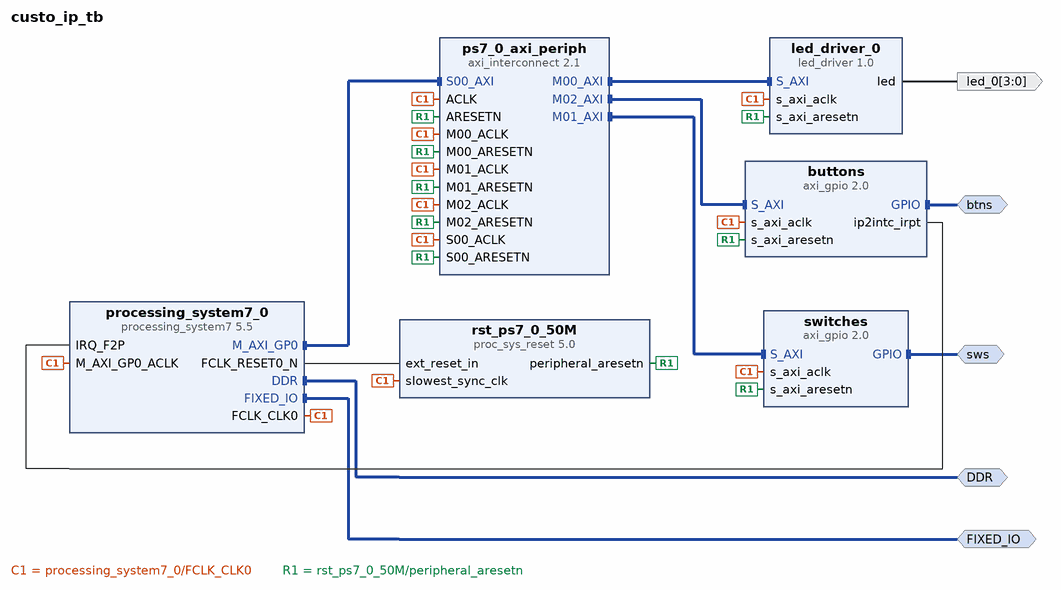
[diagram p0: block diagram of the top level]
# Vivado block design custo_ip_tb, xc7z010clg400-1, Vivado 2018.3
create_bd_design custo_ip_tb

create_bd_intf_port -mode Master -vlnv xilinx.com:interface:ddrx_rtl:1.0 DDR
create_bd_intf_port -mode Master -vlnv xilinx.com:display_processing_system7:fixedio_rtl:1.0 FIXED_IO
create_bd_intf_port -mode Master -vlnv xilinx.com:interface:gpio_rtl:1.0 sws
create_bd_intf_port -mode Master -vlnv xilinx.com:interface:gpio_rtl:1.0 btns
create_bd_port -dir O -from 3 -to 0 led_0

create_bd_cell -type ip -vlnv xilinx.com:user:led_driver:1.0 led_driver_0
create_bd_cell -type ip -vlnv xilinx.com:ip:processing_system7:5.5 processing_system7_0
set_property -dict [list \
  CONFIG.PCW_APU_PERIPHERAL_FREQMHZ 667 \
  CONFIG.PCW_ENET0_ENET0_IO {MIO 16 .. 27} \
  CONFIG.PCW_ENET0_GRP_MDIO_ENABLE 1 \
  CONFIG.PCW_ENET0_GRP_MDIO_IO {MIO 52 .. 53} \
  CONFIG.PCW_ENET0_PERIPHERAL_ENABLE 1 \
  CONFIG.PCW_ENET0_RESET_ENABLE 0 \
  CONFIG.PCW_ENET_RESET_ENABLE 1 \
  CONFIG.PCW_ENET_RESET_SELECT {Share reset pin} \
  CONFIG.PCW_GPIO_MIO_GPIO_ENABLE 1 \
  CONFIG.PCW_GPIO_MIO_GPIO_IO MIO \
  CONFIG.PCW_I2C_RESET_ENABLE 1 \
  CONFIG.PCW_IRQ_F2P_INTR 1 \
  CONFIG.PCW_PRESET_BANK1_VOLTAGE {LVCMOS 1.8V} \
  CONFIG.PCW_QSPI_GRP_FBCLK_ENABLE 1 \
  CONFIG.PCW_QSPI_GRP_FBCLK_IO {MIO 8} \
  CONFIG.PCW_QSPI_GRP_SINGLE_SS_ENABLE 1 \
  CONFIG.PCW_QSPI_GRP_SINGLE_SS_IO {MIO 1 .. 6} \
  CONFIG.PCW_QSPI_PERIPHERAL_ENABLE 1 \
  CONFIG.PCW_QSPI_QSPI_IO {MIO 1 .. 6} \
  CONFIG.PCW_SD0_GRP_CD_ENABLE 1 \
  CONFIG.PCW_SD0_GRP_CD_IO {MIO 47} \
  CONFIG.PCW_SD0_GRP_WP_ENABLE 0 \
  CONFIG.PCW_SD0_PERIPHERAL_ENABLE 1 \
  CONFIG.PCW_SD0_SD0_IO {MIO 40 .. 45} \
  CONFIG.PCW_SDIO_PERIPHERAL_FREQMHZ 50 \
  CONFIG.PCW_SINGLE_QSPI_DATA_MODE x4 \
  CONFIG.PCW_UART1_PERIPHERAL_ENABLE 1 \
  CONFIG.PCW_UART1_UART1_IO {MIO 48 .. 49} \
  CONFIG.PCW_UART_PERIPHERAL_FREQMHZ 100 \
  CONFIG.PCW_UIPARAM_DDR_FREQ_MHZ 533.333333 \
  CONFIG.PCW_UIPARAM_DDR_MEMORY_TYPE {DDR 3 (Low Voltage)} \
  CONFIG.PCW_UIPARAM_DDR_PARTNO {MT41K256M16 RE-125} \
  CONFIG.PCW_USB0_PERIPHERAL_ENABLE 1 \
  CONFIG.PCW_USB0_RESET_ENABLE 1 \
  CONFIG.PCW_USB0_RESET_IO {MIO 46} \
  CONFIG.PCW_USB0_USB0_IO {MIO 28 .. 39} \
  CONFIG.PCW_USB_RESET_ENABLE 1 \
  CONFIG.PCW_USB_RESET_SELECT {Share reset pin} \
  CONFIG.PCW_USE_FABRIC_INTERRUPT 1 \
] [get_bd_cells processing_system7_0]
# 296 more settings of processing_system7_0 are not shown: defaults, MIO pin electricals, DDR timing, and values the tool derives
create_bd_cell -type ip -vlnv xilinx.com:ip:axi_interconnect:2.1 ps7_0_axi_periph
set_property -dict {CONFIG.NUM_MI 3} [get_bd_cells ps7_0_axi_periph]
create_bd_cell -type ip -vlnv xilinx.com:ip:proc_sys_reset:5.0 rst_ps7_0_50M
create_bd_cell -type ip -vlnv xilinx.com:ip:axi_gpio:2.0 switches
set_property -dict {CONFIG.GPIO_BOARD_INTERFACE sws_4bits} [get_bd_cells switches]
create_bd_cell -type ip -vlnv xilinx.com:ip:axi_gpio:2.0 buttons
set_property -dict {CONFIG.C_INTERRUPT_PRESENT 1 CONFIG.GPIO_BOARD_INTERFACE btns_4bits} [get_bd_cells buttons]

# ---- connections ----

connect_bd_intf_net [get_bd_intf_ports btns] [get_bd_intf_pins buttons/GPIO]
connect_bd_intf_net [get_bd_intf_ports sws] [get_bd_intf_pins switches/GPIO]
connect_bd_intf_net [get_bd_intf_ports DDR] [get_bd_intf_pins processing_system7_0/DDR]
connect_bd_intf_net [get_bd_intf_ports FIXED_IO] [get_bd_intf_pins processing_system7_0/FIXED_IO]
connect_bd_intf_net [get_bd_intf_pins processing_system7_0/M_AXI_GP0] [get_bd_intf_pins ps7_0_axi_periph/S00_AXI]
connect_bd_intf_net [get_bd_intf_pins ps7_0_axi_periph/M00_AXI] [get_bd_intf_pins led_driver_0/S_AXI]
connect_bd_intf_net [get_bd_intf_pins ps7_0_axi_periph/M01_AXI] [get_bd_intf_pins switches/S_AXI]
connect_bd_intf_net [get_bd_intf_pins ps7_0_axi_periph/M02_AXI] [get_bd_intf_pins buttons/S_AXI]
connect_bd_net [get_bd_pins processing_system7_0/FCLK_CLK0] \
  [get_bd_pins processing_system7_0/M_AXI_GP0_ACLK] [get_bd_pins ps7_0_axi_periph/S00_ACLK] \
  [get_bd_pins rst_ps7_0_50M/slowest_sync_clk] [get_bd_pins led_driver_0/s_axi_aclk] [get_bd_pins ps7_0_axi_periph/M00_ACLK] \
  [get_bd_pins ps7_0_axi_periph/ACLK] [get_bd_pins switches/s_axi_aclk] [get_bd_pins ps7_0_axi_periph/M01_ACLK] \
  [get_bd_pins buttons/s_axi_aclk] [get_bd_pins ps7_0_axi_periph/M02_ACLK]
connect_bd_net [get_bd_pins processing_system7_0/FCLK_RESET0_N] [get_bd_pins rst_ps7_0_50M/ext_reset_in]
connect_bd_net [get_bd_pins rst_ps7_0_50M/peripheral_aresetn] \
  [get_bd_pins ps7_0_axi_periph/S00_ARESETN] [get_bd_pins led_driver_0/s_axi_aresetn] \
  [get_bd_pins ps7_0_axi_periph/M00_ARESETN] [get_bd_pins ps7_0_axi_periph/ARESETN] [get_bd_pins switches/s_axi_aresetn] \
  [get_bd_pins ps7_0_axi_periph/M01_ARESETN] [get_bd_pins buttons/s_axi_aresetn] [get_bd_pins ps7_0_axi_periph/M02_ARESETN]
connect_bd_net [get_bd_pins led_driver_0/led] [get_bd_ports led_0]
connect_bd_net [get_bd_pins buttons/ip2intc_irpt] [get_bd_pins processing_system7_0/IRQ_F2P]

# ---- address map ----
assign_bd_address -offset 0x41200000 -range 64K -target_address_space [get_bd_addr_spaces processing_system7_0/Data] [get_bd_addr_segs switches/S_AXI/Reg]
assign_bd_address -offset 0x41210000 -range 64K -target_address_space [get_bd_addr_spaces processing_system7_0/Data] [get_bd_addr_segs buttons/S_AXI/Reg]
assign_bd_address -offset 0x43C00000 -range 64K -target_address_space [get_bd_addr_spaces processing_system7_0/Data] [get_bd_addr_segs led_driver_0/S_AXI/S_AXI_reg]

validate_bd_design
save_bd_design
